# EAGLE schematic isd main lighting board (EAGLE 9.6.2)
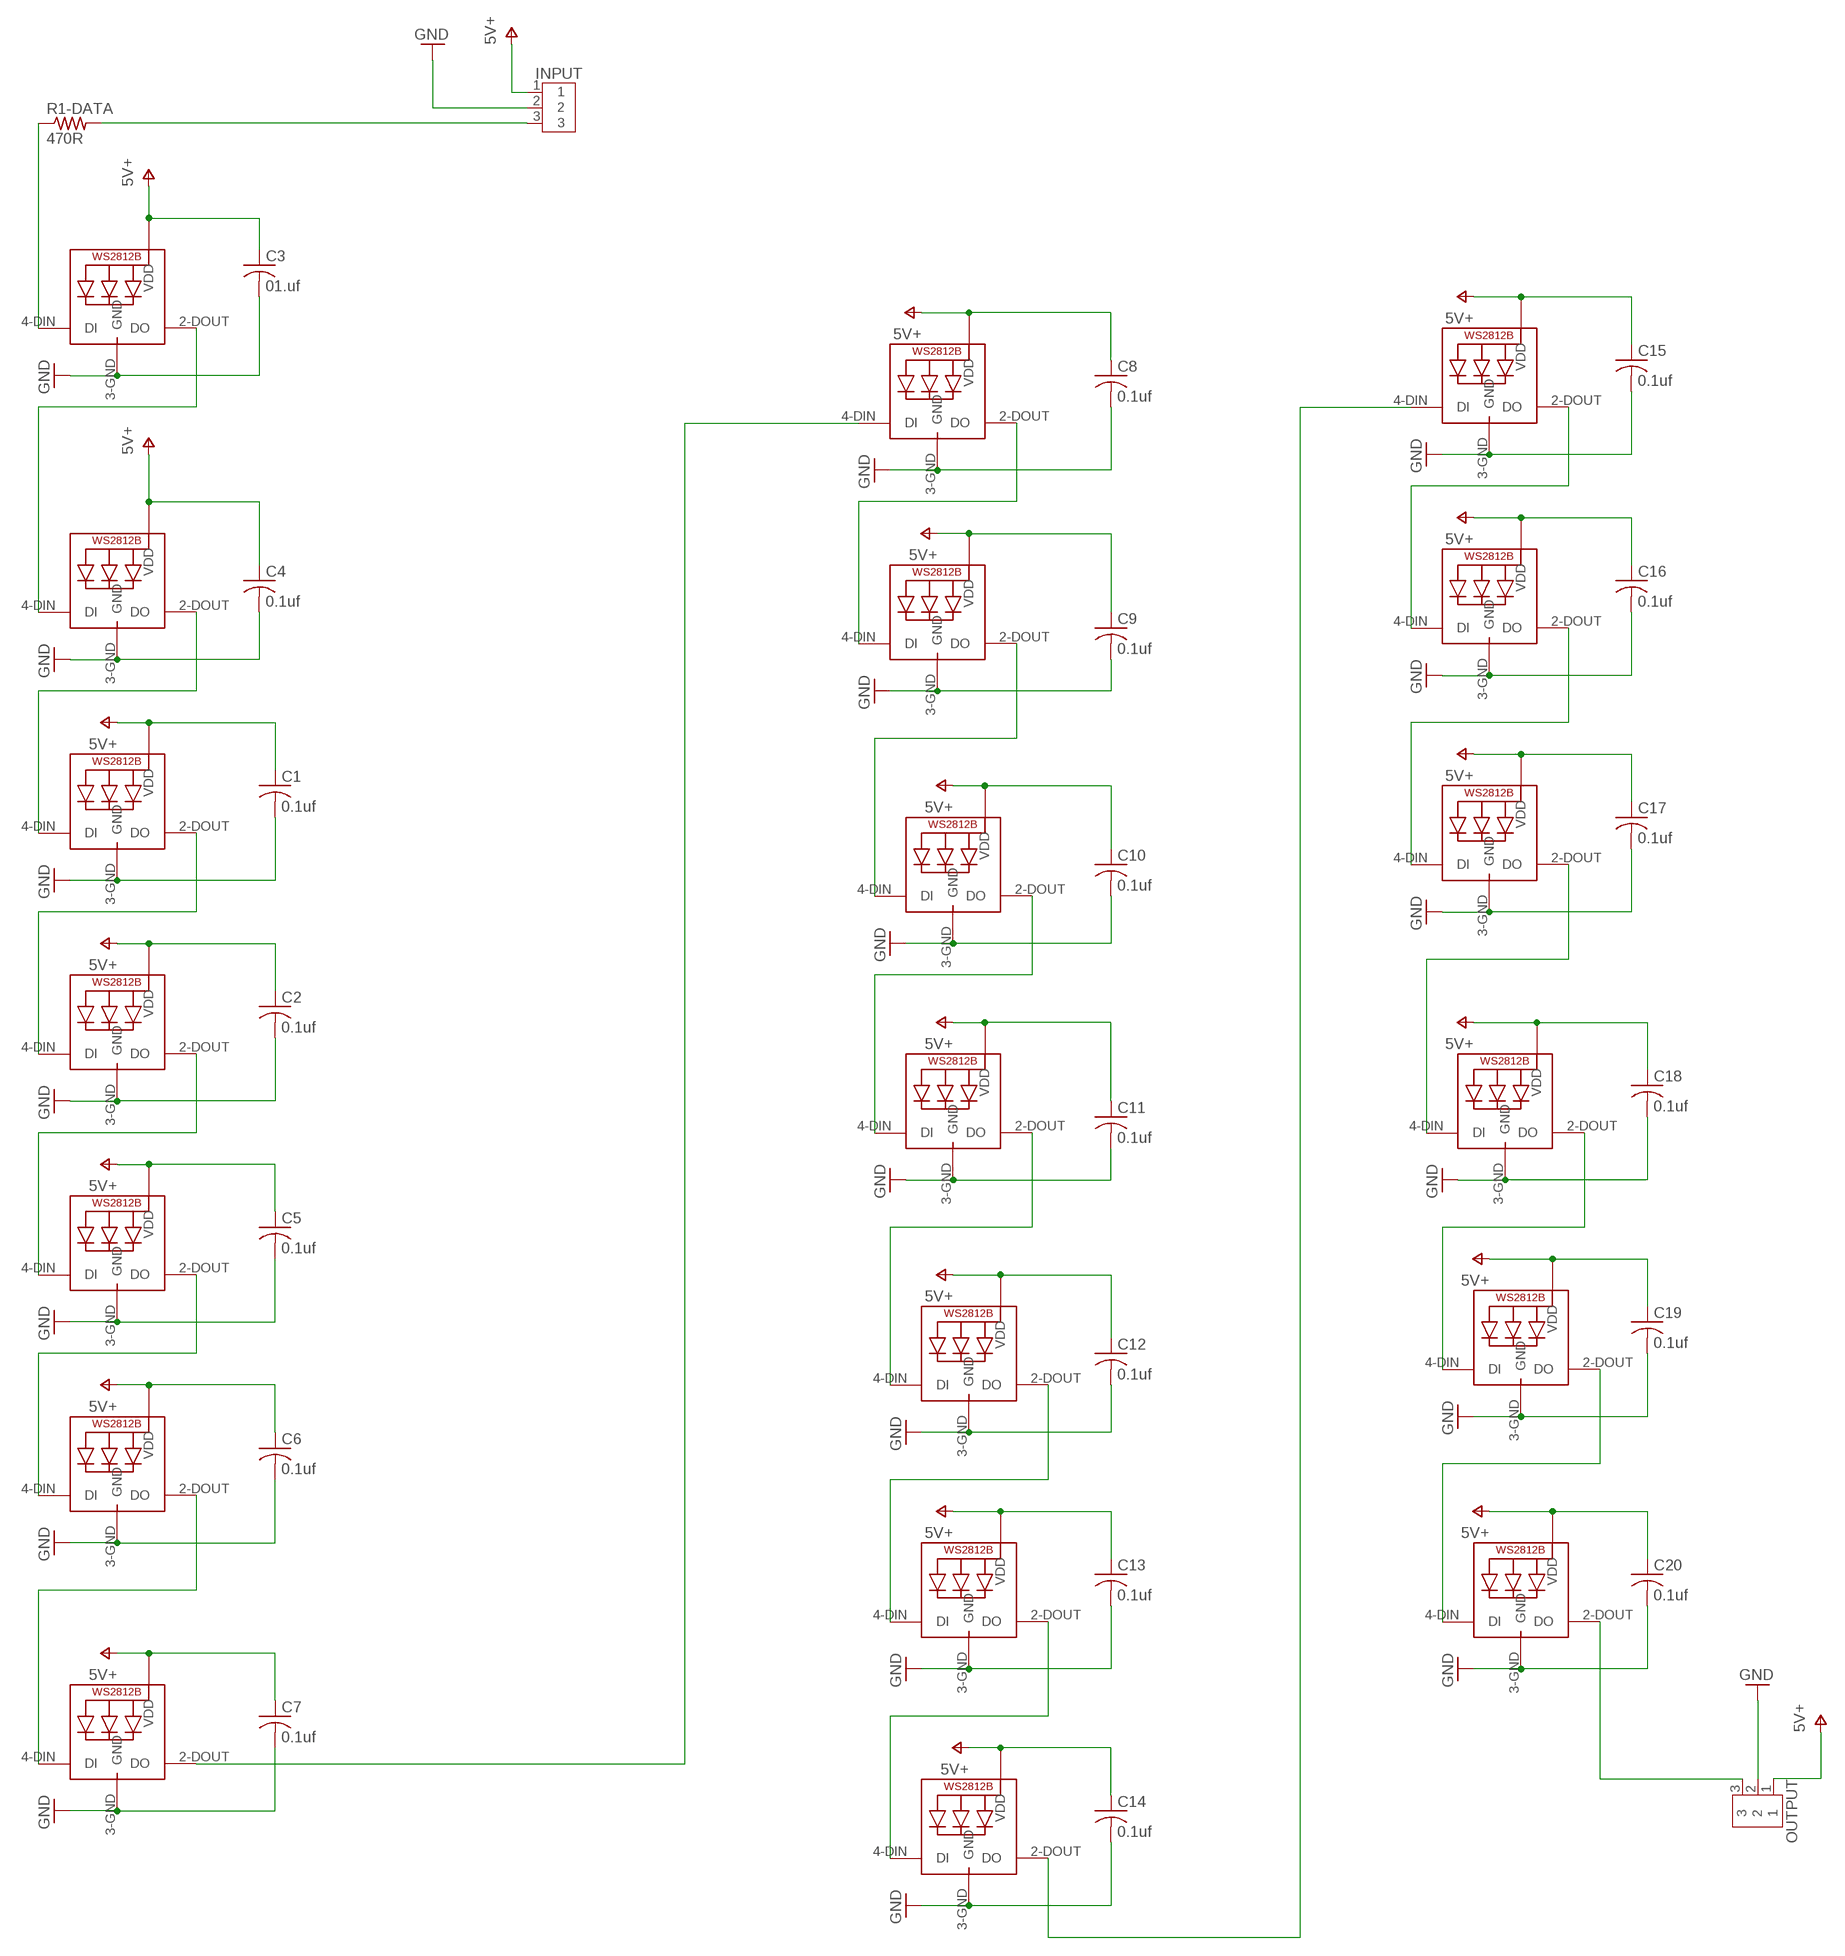
[diagram p0: schematic, sheet 1]

## Parts
C1  0.1uf  C-USC0805K  [C0805K]
C2  0.1uf  C-USC0805K  [C0805K]
C3  01.uf  C-USC0805K  [C0805K]
C4  0.1uf  C-USC0805K  [C0805K]
C5  0.1uf  C-USC0805K  [C0805K]
C6  0.1uf  C-USC0805K  [C0805K]
C7  0.1uf  C-USC0805K  [C0805K]
C8  0.1uf  C-USC0805K  [C0805K]
C9  0.1uf  C-USC0805K  [C0805K]
C10  0.1uf  C-USC0805K  [C0805K]
C11  0.1uf  C-USC0805K  [C0805K]
C12  0.1uf  C-USC0805K  [C0805K]
C13  0.1uf  C-USC0805K  [C0805K]
C14  0.1uf  C-USC0805K  [C0805K]
C15  0.1uf  C-USC0805K  [C0805K]
C16  0.1uf  C-USC0805K  [C0805K]
C17  0.1uf  C-USC0805K  [C0805K]
C18  0.1uf  C-USC0805K  [C0805K]
C19  0.1uf  C-USC0805K  [C0805K]
C20  0.1uf  C-USC0805K  [C0805K]
INPUT  B3B-XH-A  [B3B-XH-A]
OUTPUT  B3B-XH-A  [B3B-XH-A]
R1-DATA  470R  R-US_0204/5  [0204/5]
RGB1  WS2812B_5050N  [WS2812B-NARROW]
RGB2  WS2812B_5050N  [WS2812B-NARROW]
RGB3  WS2812B_5050N  [WS2812B-NARROW]
RGB4  WS2812B_5050N  [WS2812B-NARROW]
RGB5  WS2812B_5050N  [WS2812B-NARROW]
RGB6  WS2812B_5050N  [WS2812B-NARROW]
RGB7  WS2812B_5050N  [WS2812B-NARROW]
RGB8  WS2812B_5050N  [WS2812B-NARROW]
RGB9  WS2812B_5050N  [WS2812B-NARROW]
RGB10  WS2812B_5050N  [WS2812B-NARROW]
RGB11  WS2812B_5050N  [WS2812B-NARROW]
RGB12  WS2812B_5050N  [WS2812B-NARROW]
RGB13  WS2812B_5050N  [WS2812B-NARROW]
RGB14  WS2812B_5050N  [WS2812B-NARROW]
RGB15  WS2812B_5050N  [WS2812B-NARROW]
RGB16  WS2812B_5050N  [WS2812B-NARROW]
RGB17  WS2812B_5050N  [WS2812B-NARROW]
RGB18  WS2812B_5050N  [WS2812B-NARROW]
RGB19  WS2812B_5050N  [WS2812B-NARROW]
RGB20  WS2812B_5050N  [WS2812B-NARROW]

## Nets
GND: C1.2 C2.2 C3.2 C4.2 C5.2 C6.2 C7.2 C8.2 C9.2 C10.2 C11.2 C12.2 C13.2 C14.2 C15.2 C16.2 C17.2 C18.2 C19.2 C20.2 INPUT.2 OUTPUT.2 RGB1.3-GND(GND) RGB2.3-GND(GND) RGB3.3-GND(GND) RGB4.3-GND(GND) RGB5.3-GND(GND) RGB6.3-GND(GND) RGB7.3-GND(GND) RGB8.3-GND(GND) RGB9.3-GND(GND) RGB10.3-GND(GND) RGB11.3-GND(GND) RGB12.3-GND(GND) RGB13.3-GND(GND) RGB14.3-GND(GND) RGB15.3-GND(GND) RGB16.3-GND(GND) RGB17.3-GND(GND) RGB18.3-GND(GND) RGB19.3-GND(GND) RGB20.3-GND(GND)
N$1: R1-DATA.1 RGB1.4-DIN(DI)
N$2: RGB1.2-DOUT(DO) RGB2.4-DIN(DI)
N$3: RGB2.2-DOUT(DO) RGB3.4-DIN(DI)
N$4: INPUT.3 R1-DATA.2
N$5: RGB3.2-DOUT(DO) RGB4.4-DIN(DI)
N$6: OUTPUT.3 RGB20.2-DOUT(DO)
N$7: RGB4.2-DOUT(DO) RGB5.4-DIN(DI)
N$8: RGB8.2-DOUT(DO) RGB9.4-DIN(DI)
N$9: RGB5.2-DOUT(DO) RGB6.4-DIN(DI)
N$10: RGB6.2-DOUT(DO) RGB7.4-DIN(DI)
N$11: RGB7.2-DOUT(DO) RGB8.4-DIN(DI)
N$12: RGB9.2-DOUT(DO) RGB10.4-DIN(DI)
N$14: RGB10.2-DOUT(DO) RGB11.4-DIN(DI)
N$15: RGB11.2-DOUT(DO) RGB12.4-DIN(DI)
N$17: RGB12.2-DOUT(DO) RGB13.4-DIN(DI)
N$19: RGB13.2-DOUT(DO) RGB14.4-DIN(DI)
N$21: RGB14.2-DOUT(DO) RGB15.4-DIN(DI)
N$23: RGB15.2-DOUT(DO) RGB16.4-DIN(DI)
N$25: RGB16.2-DOUT(DO) RGB17.4-DIN(DI)
N$27: RGB17.2-DOUT(DO) RGB18.4-DIN(DI)
N$29: RGB18.2-DOUT(DO) RGB19.4-DIN(DI)
N$31: RGB19.2-DOUT(DO) RGB20.4-DIN(DI)
V+: C1.1 C2.1 C3.1 C4.1 C5.1 C6.1 C7.1 C8.1 C9.1 C10.1 C11.1 C12.1 C13.1 C14.1 C15.1 C16.1 C17.1 C18.1 C19.1 C20.1 INPUT.1 OUTPUT.1 RGB1.1-VDD(VDD) RGB2.1-VDD(VDD) RGB3.1-VDD(VDD) RGB4.1-VDD(VDD) RGB5.1-VDD(VDD) RGB6.1-VDD(VDD) RGB7.1-VDD(VDD) RGB8.1-VDD(VDD) RGB9.1-VDD(VDD) RGB10.1-VDD(VDD) RGB11.1-VDD(VDD) RGB12.1-VDD(VDD) RGB13.1-VDD(VDD) RGB14.1-VDD(VDD) RGB15.1-VDD(VDD) RGB16.1-VDD(VDD) RGB17.1-VDD(VDD) RGB18.1-VDD(VDD) RGB19.1-VDD(VDD) RGB20.1-VDD(VDD) ; supply symbol labelled 5V+

## Library data of the parts
C1-C20 = rcl:C-US: CAPACITOR, American symbol; SPICEPREFIX: C
INPUT OUTPUT = Connector:B3B-XH-A: XH Connector Top Entry - 3POS Details see: Datasheet <http://www.jst-mfg.com/product/pdf/eng/eXH.pdf>; CATEGORY: CONNECTOR; DESCRIPTION: 2.5mm pitch/disconnectable crimp style connector; MANUFACTURER: JST (XH connector); MPN: B3B-XH-A; PART_STATUS: ACTIVE; ROHS_COMPLIANT: COMPLIANT; SERIES: B3B-XH-A; SPICEPREFIX: X; SUB_CATEGORY: THROUGH HOLE CONNECTOR; TYPE: SIDE ENTRY; VALUE: 3A/250V
R1-DATA = adafruit:R-US_: RESISTOR, American symbol; SPICEPREFIX: R
RGB1 = adafruit:WS2812B
RGB2-RGB20 = adafruit:WS2812B; SPICEPREFIX: E

## Net classes
0 default: width 0.305 mm, drill 0.508 mm, clearance 0.254 mm